# EAGLE design zerocam1S (EAGLE 9.5.0)
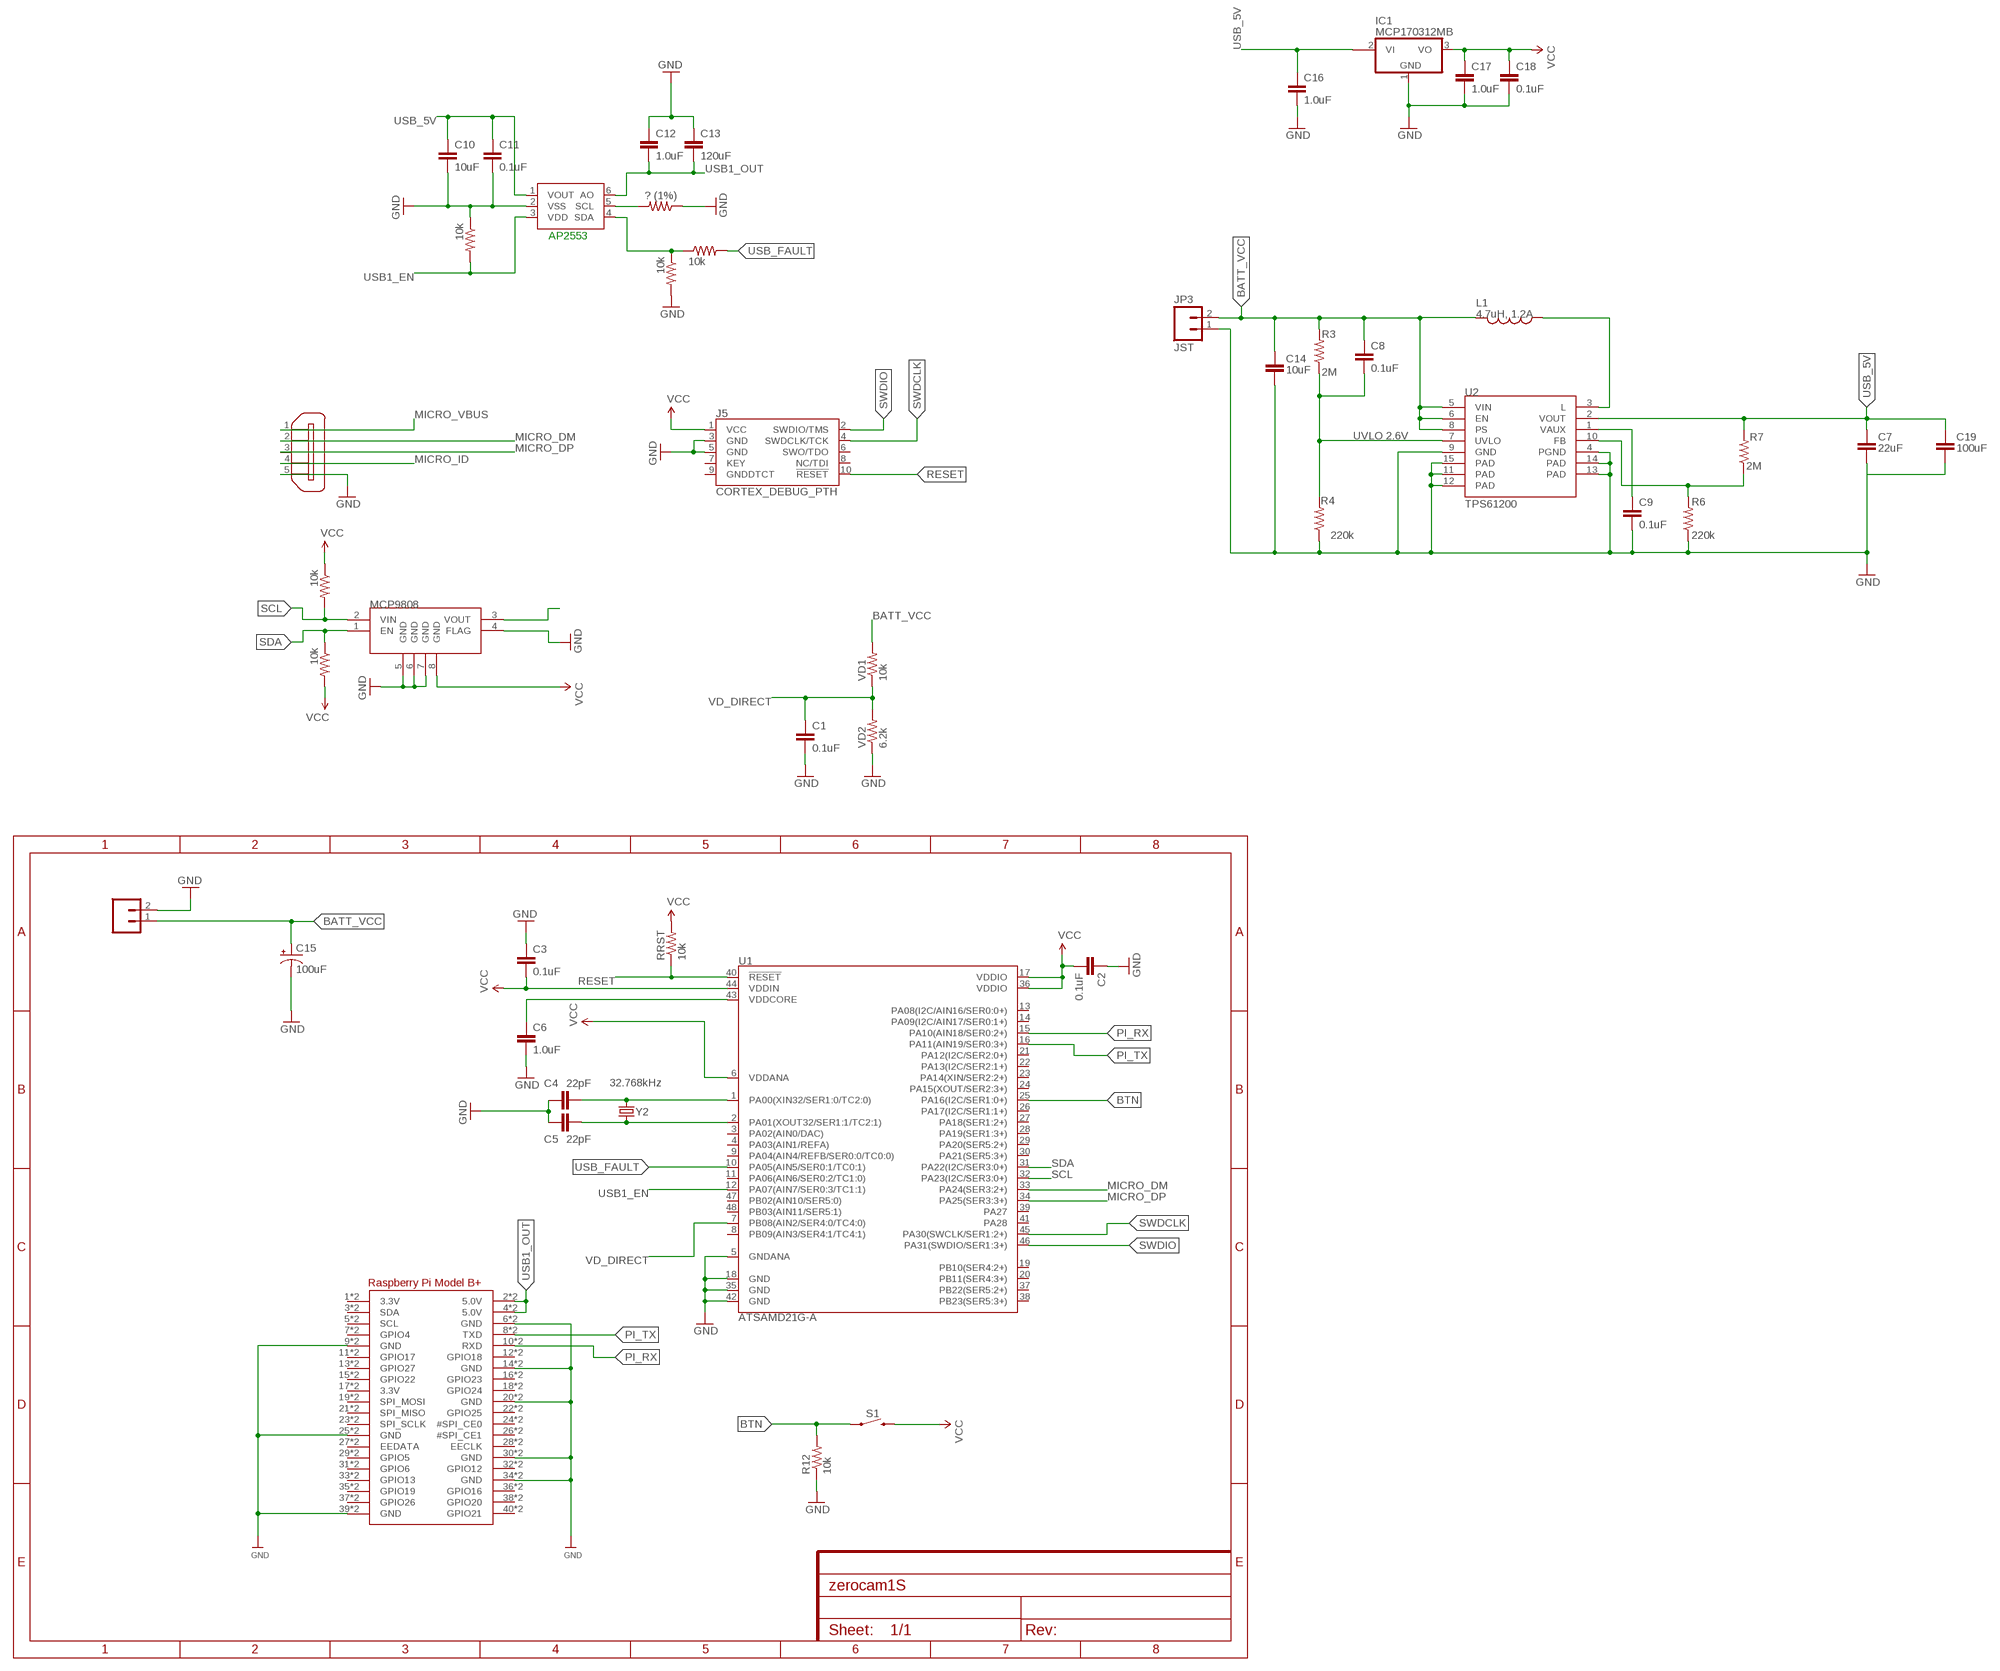
[diagram p0: schematic, sheet 1]

## Parts
AP2553  MCP4725  MCP4725SOT-23  [SOT23-6]
C1  0.1uF  CAP0805  [0805]
C2  0.1uF  1.0UF-0805-25V-10%  [0805]
C3  0.1uF  1.0UF-0805-25V-10%  [0805]
C4  22pF  CAP0805  [0805]
C5  22pF  CAP0805  [0805]
C6  1.0uF  1.0UF-0805-25V-10%  [0805]
C7  22uF  CAP0805  [0805]
C8  0.1uF  CAP0805  [0805]
C9  0.1uF  CAP0805  [0805]
C10  10uF  1.0UF-0805-25V-10%  [0805]
C11  0.1uF  1.0UF-0805-25V-10%  [0805]
C12  1.0uF  1.0UF-1206-50V-10%  [1206]
C13  120uF  1.0UF-1206-50V-10%  [1206]
C14  10uF  CAP1206  [1206]
C15  100uF  100UF-POLAR-25V-20%(ELEC)  [PANASONIC_D]
C16  1.0uF  1.0UF-0805-25V-10%  [0805]
C17  1.0uF  1.0UF-1206-50V-10%  [1206]
C18  0.1uF  1.0UF-0805-25V-10%  [0805]
C19  100uF  CAP1206  [1206]
IC1  MCP170312MB  [SOT89]
J1  CONN_023.5MM-NO_SILK  [SCREWTERMINAL-3.5MM-2-NS]
J5  CORTEX_DEBUG_PTH  [2X5-PTH-1.27MM]
JP3  JST  M02-JST-2MM-SMT  [JST-2-SMD]
L1  4.7uH, 1.2A  INDUCTOR.  [CDRH2D09]
MCP9808  V_REG_MIC5216  [MSOP8]
R3  2M  RESISTOR0805-RES  [0805]
R4  220k  RESISTOR0805-RES  [0805]
R6  220k  RESISTOR0805-RES  [0805]
R7  2M  RESISTOR0805-RES  [0805]
R12  10k  RESISTOR0805-RES  [0805]
R_I2C_1  10k  RESISTOR0805-RES  [0805]
R_I2C_2  10k  RESISTOR0805-RES  [0805]
R_MOSFET_USB1  ? (1%)  RESISTOR0805-RES  [0805]
R_MOSFET_USB2  10k  RESISTOR0805-RES  [0805]
R_MOSFET_USB3  10k  RESISTOR0805-RES  [0805]
R_MOSFET_USB4  10k  RESISTOR0805-RES  [0805]
RPI1  RASPBERRYPI_BPLUS_BONNET_THMSMT  [PI_BONNET_THMSMT]
RRST  10k  RESISTOR0805-RES  [0805]
S1  MOMENTARY-SWITCH-SPST-SMD-5.2-REDUNDANT  [TACTILE_SWITCH_SMD_5.2MM]
U1  ATSAMD21G-A  [TQFP-48]
U2  TPS61200  [QFN-10_PAD]
VD1  10k  RESISTOR0805-RES  [0805]
VD2  6.2k  RESISTOR0805-RES  [0805]
X2  ZX62D-B-5PA8  [ZX62D-B-5PA8]
Y2  32.768kHz  CRYSTAL3.2X1.5MM  [CRYSTAL-SMD-3.2X1.5MM]

## Nets
BATT_VCC: C8.1 C14.1 C15.+ J1.1 JP3.2 L1.P$2 R3.2 U2.5(VIN) U2.6(EN) U2.8(PS) VD1.2
BTN: R12.2 S1.1 S1.2 U1.25(PA16(I2C/SER1:0+))
FB: R6.2 R7.1 U2.10(FB)
GND: AP2553.2(VSS) C1.2 C2.1 C3.1 C4.1 C5.1 C6.2 C7.2 C9.2 C10.2 C11.2 C12.1 C13.1 C14.2 C15.- C16.2 C17.2 C18.2 C19.2 IC1.1(GND) J1.2 J5.3(GND) J5.5(GND) JP3.1 MCP9808.4(FLAG) MCP9808.5(GND) MCP9808.6(GND) MCP9808.7(GND) R4.1 R6.1 R12.1 R_MOSFET_USB1.1 R_MOSFET_USB2.2 R_MOSFET_USB3.1 RPI1.6(GND) RPI1.9(GND) RPI1.14(GND) RPI1.20(GND) RPI1.25(GND) RPI1.30(GND) RPI1.34(GND) RPI1.39(GND) RPI1.S6(GND) RPI1.S9(GND) RPI1.S14(GND) RPI1.S20(GND) RPI1.S25(GND) RPI1.S30(GND) RPI1.S34(GND) RPI1.S39(GND) U1.5(GNDANA) U1.18(GND) U1.35(GND) U1.42(GND) U2.4(PGND) U2.9(GND) U2.11(PAD) U2.12(PAD) U2.13(PAD) U2.14(PAD) U2.15(PAD) VD2.1 X2.5
MICRO_DM: U1.33(PA24(SER3:2+)) X2.2
MICRO_DP: U1.34(PA25(SER3:3+)) X2.3
MICRO_ID: X2.4
MICRO_VBUS: X2.1
N$1: C6.1 U1.43(VDDCORE)
N$2: L1.P$1 U2.3(L)
N$3: AP2553.5(SCL) R_MOSFET_USB1.2
N$4: MCP9808.3(VOUT)
N$5: AP2553.4(SDA) R_MOSFET_USB2.1 R_MOSFET_USB4.1
N$6: C9.1 U2.1(VAUX)
N$8: C4.2 U1.1(PA00(XIN32/SER1:0/TC2:0)) Y2.P$2
N$32: C5.2 U1.2(PA01(XOUT32/SER1:1/TC2:1)) Y2.P$1
PI_RX: RPI1.10(RXD) RPI1.S10(RXD) U1.15(PA10(AIN18/SER0:2+))
PI_TX: RPI1.8(TXD) RPI1.S8(TXD) U1.16(PA11(AIN19/SER0:3+))
RESET: J5.10(!RESET) RRST.1 U1.40(!RESET!)
SCL: MCP9808.2(VIN) R_I2C_1.2 U1.32(PA23(I2C/SER3:0+))
SDA: MCP9808.1(EN) R_I2C_2.1 U1.31(PA22(I2C/SER3:0+))
SWDCLK: J5.4(SWDCLK/TCK) U1.45(PA30(SWCLK/SER1:2+))
SWDIO: J5.2(SWDIO/TMS) U1.46(PA31(SWDIO/SER1:3+))
USB1_EN: AP2553.3(VDD) R_MOSFET_USB3.2 U1.12(PA07(AIN7/SER0:3/TC1:1))
USB1_OUT: AP2553.6(AO) C12.2 C13.2 RPI1.2(5.0V) RPI1.4(5.0V) RPI1.S2(5.0V) RPI1.S4(5.0V)
USB_5V: AP2553.1(VOUT) C7.1 C10.1 C11.1 C16.1 C19.1 IC1.2@1(VI1) R7.2 U2.2(VOUT)
USB_FAULT: R_MOSFET_USB4.2 U1.10(PA05(AIN5/SER0:1/TC0:1))
UVLO: C8.2 R3.1 R4.2 U2.7(UVLO)
VCC [power]: C2.2 C3.2 C17.1 C18.1 IC1.3(VO) J5.1(VCC) MCP9808.8(GND) R_I2C_1.1 R_I2C_2.2 RRST.2 S1.3 S1.4 U1.6(VDDANA) U1.17(VDDIO) U1.36(VDDIO) U1.44(VDDIN)
VD_DIRECT: C1.1 U1.7(PB08(AIN2/SER4:0/TC4:0)) VD1.1 VD2.2
Unconnected: IC1.2(VI) J5.6(SWO/TDO) J5.7(KEY) J5.8(NC/TDI) J5.9(GNDDTCT) RPI1.1(3.3V) RPI1.3(SDA) RPI1.5(SCL) RPI1.7(GPIO4) RPI1.11(GPIO17) RPI1.12(GPIO18) RPI1.13(GPIO27) RPI1.15(GPIO22) RPI1.16(GPIO23) RPI1.17(3.3V) RPI1.18(GPIO24) RPI1.19(SPI_MOSI) RPI1.21(SPI_MISO) RPI1.22(GPIO25) RPI1.23(SPI_SCLK) RPI1.24(#SPI_CE0) RPI1.26(#SPI_CE1) RPI1.27(EEDATA) RPI1.28(EECLK) RPI1.29(GPIO5) RPI1.31(GPIO6) RPI1.32(GPIO12) RPI1.33(GPIO13) RPI1.35(GPIO19) RPI1.36(GPIO16) RPI1.37(GPIO26) RPI1.38(GPIO20) RPI1.40(GPIO21) RPI1.S1(3.3V) RPI1.S3(SDA) RPI1.S5(SCL) RPI1.S7(GPIO4) RPI1.S11(GPIO17) RPI1.S12(GPIO18) RPI1.S13(GPIO27) RPI1.S15(GPIO22) RPI1.S16(GPIO23) RPI1.S17(3.3V) RPI1.S18(GPIO24) RPI1.S19(SPI_MOSI) RPI1.S21(SPI_MISO) RPI1.S22(GPIO25) RPI1.S23(SPI_SCLK) RPI1.S24(#SPI_CE0) RPI1.S26(#SPI_CE1) RPI1.S27(EEDATA) RPI1.S28(EECLK) RPI1.S29(GPIO5) RPI1.S31(GPIO6) RPI1.S32(GPIO12) RPI1.S33(GPIO13) RPI1.S35(GPIO19) RPI1.S36(GPIO16) RPI1.S37(GPIO26) RPI1.S38(GPIO20) RPI1.S40(GPIO21) U1.3(PA02(AIN0/DAC)) U1.4(PA03(AIN1/REFA)) U1.8(PB09(AIN3/SER4:1/TC4:1)) U1.9(PA04(AIN4/REFB/SER0:0/TC0:0)) U1.11(PA06(AIN6/SER0:2/TC1:0)) U1.13(PA08(I2C/AIN16/SER0:0+)) U1.14(PA09(I2C/AIN17/SER0:1+)) U1.19(PB10(SER4:2+)) U1.20(PB11(SER4:3+)) U1.21(PA12(I2C/SER2:0+)) U1.22(PA13(I2C/SER2:1+)) U1.23(PA14(XIN/SER2:2+)) U1.24(PA15(XOUT/SER2:3+)) U1.26(PA17(I2C/SER1:1+)) U1.27(PA18(SER1:2+)) U1.28(PA19(SER1:3+)) U1.29(PA20(SER5:2+)) U1.30(PA21(SER5:3+)) U1.37(PB22(SER5:2+)) U1.38(PB23(SER5:3+)) U1.39(PA27) U1.41(PA28) U1.47(PB02(AIN10/SER5:0)) U1.48(PB03(AIN11/SER5:1)) X2.S1 X2.S2 X2.S3 X2.S4

## Notes on the sheet
- AP2553
- UVLO 2.6V

## Library data of the parts
AP2553 = SparkFun-IC-Conversion:MCP4725: MCP4725 DAC Microchip 12-bit I2C DAC, SOT23-6 Datasheet <https://cdn.sparkfun.com/datasheets/BreakoutBoards/MCP4725_2009.pdf> SparkFun Products SparkFun I2C DAC Breakout - MCP4725 <https://www.sparkfun.com/products/12918> (BOB-12918); PROD_ID: IC-08886
C1 = SparkFun-Capacitors:CAP: Capacitor Standard 0603 ceramic capacitor, and 0.1" leaded capacitor.
C2 C3 C10 C11 C18 = SparkFun-Capacitors:1.0UF: 1µF ceramic capacitors A capacitor is a passive two-terminal electrical component used to store electrical energy temporarily in an electric field.; PROD_ID: CAP-08064; VALUE: 1.0uF
C4 C5 = SparkFun-Passives:CAP: Capacitor Standard 0603 ceramic capacitor, and 0.1" leaded capacitor.
C6 C16 = SparkFun-Capacitors:1.0UF: 1µF ceramic capacitors A capacitor is a passive two-terminal electrical component used to store electrical energy temporarily in an electric field.; PROD_ID: CAP-08064
C7 C14 C19 = CH_passive:CAP: Capacitor Standard 0603 ceramic capacitor, and 0.1" leaded capacitor.
C8 C9 = SparkFun:CAP: Capacitor Standard 0603 ceramic capacitor, and 0.1" leaded capacitor.
C12 C17 = SparkFun-Capacitors:1.0UF: 1µF ceramic capacitors A capacitor is a passive two-terminal electrical component used to store electrical energy temporarily in an electric field.; PROD_ID: CAP-09822
C13 = SparkFun-Capacitors:1.0UF: 1µF ceramic capacitors A capacitor is a passive two-terminal electrical component used to store electrical energy temporarily in an electric field.; PROD_ID: CAP-09822; VALUE: 1.0uF
C15 = SparkFun-Capacitors:100UF-POLAR: 100µF polarized capacitors A capacitor is a passive two-terminal electrical component used to store electrical energy temporarily in an electric field.; PROD_ID: CAP-12547
IC1 = linear:MCP1703*: 250 mA, 16V, Low Quiescent Current LDO Regulator Source: http://ww1.microchip.com/downloads/en/DeviceDoc/22049b.pdf
J1 = SparkFun-Connectors:CONN_02: Multi connection point. Often used as Generic Header-pin footprint for 0.1 inch spaced/style header connections On any of the 0.1 inch spaced packages, you can populate with these: Break Away Headers - Straight <https://www.sparkfun.com/products/116> (PRT-00116) Break Away Male Headers - Right Angle <https://www.sparkfun.com/products/553> (PRT-00553) Female Headers <https://www.sparkfun.com/products/115> (PRT-00115) Break Away Headers - Machine Pin <https://www.sparkfun.com/products/117> (PRT-00117) Break Away Female Headers - Swiss Machine Pin <https://www.sparkfun.com/products/743> (PRT-00743) For SCREWTERMINALS and SPRING TERMINALS visit here: Screw Terimnals on SparkFun.com <https://www.sparkfun.com/search/results?term=Screw+Terminals> (5mm/3.5mm/2.54mm spacing) This device is also useful as a general connection point to wire up your design to another part of your project. Our various solder wires solder well into these plated through hole pads. Hook-Up Wire - Assortment (Stranded, 22 AWG) <https://www.sparkfun.com/products/11375> (PRT-11375) Hook-Up Wire - Assortment (Solid Core, 22 AWG) <https://www.sparkfun.com/products/11367> (PRT-11367) View the entire wire category on our website here <https://www.sparkfun.com/categories/141> Special notes: Molex polarized connector foot print use with: PRT-08233 with associated crimp pins and housings. 2.54_SCREWTERM for use with PRT-10571. 3.5mm Screw Terminal footprints for PRT-08084 5mm Screw Terminal footprints for use with PRT-08432; PROD_ID: CONN-08399
J5 = SparkFun-Connectors:CORTEX_DEBUG: Cortex Debug Connector - 10 pin Supports JTAG debug, Serial Wire debug, and Serial Wire Viewer. PTH and SMD connector options available. General Connector Information <http://infocenter.arm.com/help/topic/com.arm.doc.faqs/attached/13634/cortex_debug_connectors.pdf> Products: PTH Connector <http://www.digikey.com/product-detail/en/cnc-tech/3220-10-0100-00/1175-1627-ND/3883661> -via Digi-Key SparkFun PSoc <https://www.sparkfun.com/products/13229> SparkFun T <https://www.sparkfun.com/products/13810>
JP3 = SparkFun:M02: Header 2 Standard 2-pin 0.1" header. Use with straight break away headers (SKU : PRT-00116), right angle break away headers (PRT-00553), swiss pins (PRT-00743), machine pins (PRT-00117), and female headers (PRT-00115). Molex polarized connector foot print use with SKU : PRT-08233 with associated crimp pins and housings.
L1 = SparkFun:INDUCTOR: Inductors Basic Inductor/Choke - 0603 and 1206. Footprints are not proven and vary greatly between part numbers.
MCP9808 = SparkFun-IC-Power:V_REG_MIC5216: 500mA LDO, MSOP8 for better dissipation; PROD_ID: IC-09527
R3 R4 R6 R7 = SparkFun:RESISTOR: Resistor Basic schematic elements and footprints for 0603, 1206, and PTH resistors.
R12 R_I2C_1 R_I2C_2 R_MOSFET_USB1-R_MOSFET_USB4 RRST VD1 VD2 = SparkFun-Passives:RESISTOR: Resistor Basic schematic elements and footprints for 0603, 1206, and PTH resistors.
RPI1 = microbuilder:RASPBERRYPI_BPLUS
S1 = SparkFun-Switches:MOMENTARY-SWITCH-SPST: Momentary Switch (Pushbutton) - SPST Normally-open (NO) SPST momentary switches (buttons, pushbuttons). Variants PTH-12MM - 12mm square, through-hole Momentary Pushbutton Switch - 12mm Square <https://www.sparkfun.com/products/9190> (COM-09190) PTH-6.0MM, PTH-6.0MM-KIT - 6.0mm square, through-hole Mini Pushbutton Switch <https://www.sparkfun.com/products/97> (COM-00097) KIT package intended for soldering kit's - only one side of pads' copper is exposed. PTH-RIGHT-ANGLE-KIT - Right-angle, through-hole Right Angle Tactile Button <https://www.sparkfun.com/products/10791> - Used on SparkFun BigTime Watch Kit <https://www.sparkfun.com/products/11734> SMD-12MM - 12mm square, surface-mount Tactile Button - SMD (12mm) <https://www.sparkfun.com/products/12993> (COM-12993) Used on SparkFun PicoBoard <https://www.sparkfun.com/products/11888> SMD-4.5MM - 4.5mm Square Trackball Switch Used on SparkFun Blackberry Trackballer Breakout <https://www.sparkfun.com/products/13169> SMD-4.6MMX2.8MM - 4.60mm x 2.80mm, surface mount Used on SparkFun SAMD21 Mini Breakout <https://www.sparkfun.com/products/13664> SMD-5.2MM, SMD-5.2-REDUNDANT - 5.2mm square, surface-mount Mini Pushbutton Switch - SMD <https://www.sparkfun.com/products/8720> (COM-08720) Used on Arduino Pro Mini <https://www.sparkfun.com/products/11114> REDUNDANT package connects both switch circuits together SMD-6.0X3.5MM - 6.0 x 3.5mm, surface mount Momentary Reset Switch SMD <https://www.sparkfun.com/products/8229> (COM-08229) SMD-6.2MM-TALL - 6.2mm square, surface mount Tactile Button - SMD (6mm) <https://www.sparkfun.com/products/12992> Used on SparkFun Digital Sandbox <https://www.sparkfun.com/products/12651> SMD-RIGHT-ANGLE - Right-angle, surface mount Used on SparkFun Block for Intel® Edison - Arduino <https://www.sparkfun.com/products/13036>; PROD_ID: SWCH-08247; SF_SKU: COM-08720
U1 = SparkFun-IC-Microcontroller:ATSAMD21G: Atmel SAMD21G SMART ARM-Based Microcontroller The Atmel ® | SMART ™ SAM D21 is a series of low-power microcontrollers using the 32-bit ARM ® Cortex ® -M0+ processor, and ranging from 32- to 64-pins with up to 256KB Flash and 32KB of SRAM. The SAM D21 devices operate at a maximum frequency of 48MHz and reach 2.46 CoreMark/MHz. They are designed for simple and intuitive migration with identical peripheral modules, hex compatible code, identical linear address map and pin compatible migration paths between all devices in the product series. All devices include intelligent and flexible peripherals, Atmel Event System for inter-peripheral signaling, and support for capacitive touch button, slider and wheel user interfaces. Datasheet <https://cdn.sparkfun.com/datasheets/Dev/Arduino/Boards/Atmel-42181-SAM-D21_Datasheet.pdf> SparkFun Products SparkFun SAMD21 Mini Breakout <https://www.sparkfun.com/products/13664> (DEV-13664) SparkFun SAMD21 Dev Breakout <https://www.sparkfun.com/products/13672> (DEV-13672); PROD_ID: IC-13064
U2 = SparkFun:TPS61200: DC to DC Booster
X2 = zx62d-b-5pa8-oshpark_10:ZX62D-B-5PA8: Micro USB Type B Connector - Standard, Shell Through Hole Source: http://www.hirose.co.jp/cataloge_hp/ed_ZX_20140804.pdf; MF: Hirose; MPN: ZX62D-B-5PA8; OC_FARNELL: 2300438; OC_NEWARK: 69W0712
Y2 = samd21-temp:CRYSTAL: Various standard crystals. Proven footprints.; PROD_ID: XTAL-13062

## Net classes
1 power: width 0.254 mm, clearance 0.203 mm
4 highpower: clearance 0.305 mm

## Board
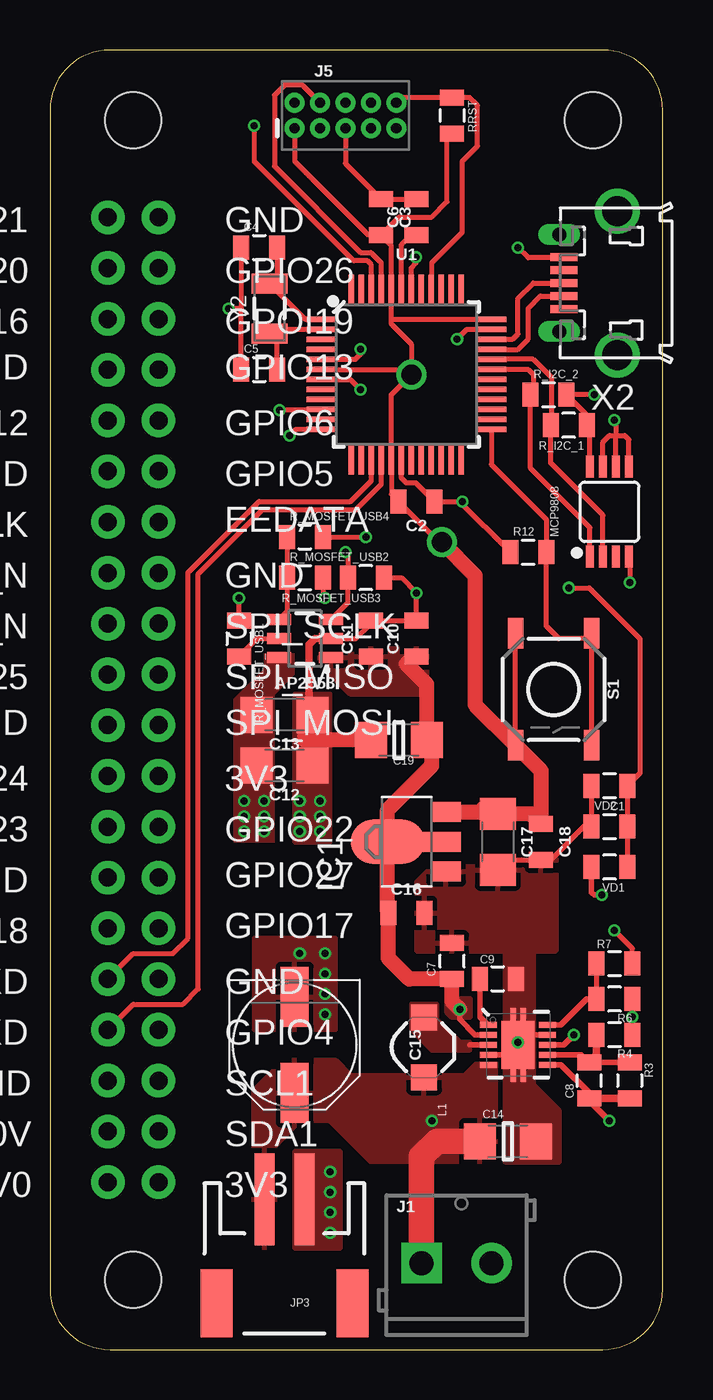
[diagram p1: board, top side]
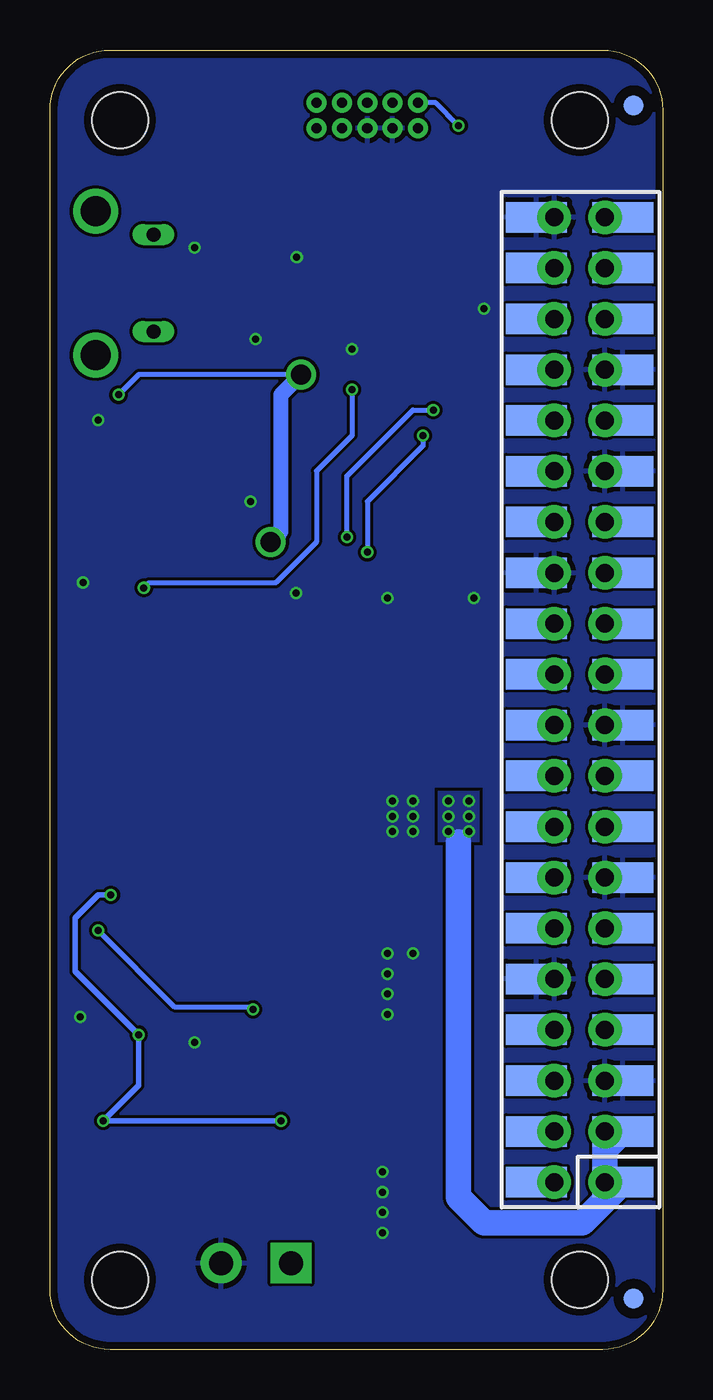
[diagram p2: board, bottom side, seen from below]

Size 30.66 x 65 mm. Coordinates in mm from the lower left corner, seen from the top.
Copper layers (1*16): Top 0.035559375mm / dielectric 1.6mm / Bottom 0.035559375mm
Design rules "oshpark-2layer": minimum track width 6mil, minimum drill 10mil, track to track 6mil, track to pad 6mil, pad to pad 6mil, via to via 6mil, smd to smd 6mil, copper to edge 15mil, drill to drill 6mil, minimum pad ring 5mil, minimum via ring 5mil, stop-mask expansion 2.5mil, vias tented up to drill 0mil, thermal gap 10mil

### Footprints (pad centres in the part's own frame; a part is rotated, then mirrored left to right if it is on the bottom)
SOT23-6 = smd 0.55 x 1.2: 1 0.95,1.3; 2 0,1.3; 3 -0.95,1.3; 4 -0.95,-1.3; 5 0,-1.3; 6 0.95,-1.3
0805 = smd 0.8 x 1.2: 1 -0.9,0; 2 0.9,0
1206 = smd 1.6 x 1.8: 1 -1.4,0; 2 1.4,0
PANASONIC_D = smd 3 x 1.4: + 2.4,0; - -2.4,0
SOT89 = smd 1 x 1.5: 1 -1.499,-1.981; 3 1.499,-1.981 | smd 1 x 2: 2 0,-1.727 | smd 2.2 x 3.7: 2@1 0,0.94
SCREWTERMINAL-3.5MM-2-NS = drill 1.2 pad 2.032 square: 1 0,0 | drill 1.2 pad 2.032: 2 3.5,0
2X5-PTH-1.27MM = drill 0.508 pad 1: 1 -2.54,-0.635; 2 -2.54,0.635; 3 -1.27,-0.635; 4 -1.27,0.635; 5 0,-0.635; 6 0,0.635; 7 1.27,-0.635; 8 1.27,0.635; 9 2.54,-0.635; 10 2.54,0.635
JST-2-SMD = smd 1 x 4.6: 1 -1,-3.7; 2 1,-3.7 | smd 1.6 x 3.4: NC1 -3.4,1.5; NC2 3.4,1.5
CDRH2D09 = smd 1.3 x 1.3: P$1 -1.5,0; P$2 1.5,0
MSOP8 = smd 0.4 x 1.1: 1 -0.975,-2.25; 2 -0.325,-2.25; 3 0.325,-2.25; 4 0.975,-2.25; 5 0.975,2.25; 6 0.325,2.25; 7 -0.325,2.25; 8 -0.975,2.25
PI_BONNET_THMSMT = drill 0.9 pad 1.676: 1 8.37,25.23; 2 8.37,27.77; 3 10.91,25.23; 4 10.91,27.77; 5 13.45,25.23; 6 13.45,27.77; 7 15.99,25.23; 8 15.99,27.77; 9 18.53,25.23; 10 18.53,27.77; 11 21.07,25.23; 12 21.07,27.77; 13 23.61,25.23; 14 23.61,27.77; 15 26.15,25.23; 16 26.15,27.77; 17 28.69,25.23; 18 28.69,27.77; 19 31.23,25.23; 20 31.23,27.77; 21 33.77,25.23; 22 33.77,27.77; 23 36.31,25.23; 24 36.31,27.77; 25 38.85,25.23; 26 38.85,27.77; 27 41.39,25.23; 28 41.39,27.77; 29 43.93,25.23; 30 43.93,27.77; 31 46.47,25.23; 32 46.47,27.77; 33 49.01,25.23; 34 49.01,27.77; 35 51.55,25.23; 36 51.55,27.77; 37 54.09,25.23; 38 54.09,27.77; 39 56.63,25.23; 40 56.63,27.77 | smd 1 x 1 bottom: 41 2.54,29.21; 42 62.23,29.21 | smd 1.524 x 3.048 bottom: S1 8.37,24.339; S2 8.37,28.657; S3 10.91,24.339; S4 10.91,28.657; S5 13.45,24.339; S6 13.45,28.657; S7 15.99,24.339; S8 15.99,28.657; S9 18.53,24.339; S10 18.53,28.657; S11 21.07,24.339; S12 21.07,28.657; S13 23.61,24.339; S14 23.61,28.657; S15 26.15,24.339; S16 26.15,28.657; S17 28.69,24.339; S18 28.69,28.657; S19 31.23,24.339; S20 31.23,28.657; S21 33.77,24.339; S22 33.77,28.657; S23 36.31,24.339; S24 36.31,28.657; S25 38.85,24.339; S26 38.85,28.657; S27 41.39,24.339; S28 41.39,28.657; S29 43.93,24.339; S30 43.93,28.657; S31 46.47,24.339; S32 46.47,28.657; S33 49.01,24.339; S34 49.01,28.657; S35 51.55,24.339; S36 51.55,28.657; S37 54.09,24.339; S38 54.09,28.657; S39 56.63,24.339; S40 56.63,28.657 | hole 2.8: 3.5,26.5; 61.5,26.5; 61.5,3.5; 3.5,3.5
TACTILE_SWITCH_SMD_5.2MM = smd 1.524 x 0.762: 1 -2.794,1.905; 2 2.794,1.905; 3 -2.794,-1.905; 4 2.794,-1.905
TQFP-48 = smd 1.5 x 0.28: 1 -4.25,2.75; 2 -4.25,2.25; 3 -4.25,1.75; 4 -4.25,1.25; 5 -4.25,0.75; 6 -4.25,0.25; 7 -4.25,-0.25; 8 -4.25,-0.75; 9 -4.25,-1.25; 10 -4.25,-1.75; 11 -4.25,-2.25; 12 -4.25,-2.75; 25 4.25,-2.75; 26 4.25,-2.25; 27 4.25,-1.75; 28 4.25,-1.25; 29 4.25,-0.75; 30 4.25,-0.25; 31 4.25,0.25; 32 4.25,0.75; 33 4.25,1.25; 34 4.25,1.75; 35 4.25,2.25; 36 4.25,2.75 | smd 0.28 x 1.5: 13 -2.75,-4.25; 14 -2.25,-4.25; 15 -1.75,-4.25; 16 -1.25,-4.25; 17 -0.75,-4.25; 18 -0.25,-4.25; 19 0.25,-4.25; 20 0.75,-4.25; 21 1.25,-4.25; 22 1.75,-4.25; 23 2.25,-4.25; 24 2.75,-4.25; 37 2.75,4.25; 38 2.25,4.25; 39 1.75,4.25; 40 1.25,4.25; 41 0.75,4.25; 42 0.25,4.25; 43 -0.25,4.25; 44 -0.75,4.25; 45 -1.25,4.25; 46 -1.75,4.25; 47 -2.25,4.25; 48 -2.75,4.25
QFN-10_PAD = smd 0.297 x 0.85: 1 -1,-1.475; 2 -0.5,-1.475; 3 0,-1.475; 4 0.5,-1.475; 5 1,-1.475; 6 1,1.475; 7 0.5,1.475; 8 0,1.475; 9 -0.5,1.475; 10 -1,1.475 | smd 0.7 x 0.28: 11 -1.5,0.25; 12 -1.5,-0.25; 13 1.5,0.25; 14 1.5,-0.25 | smd 2.4 x 1.65: 15 0,0
ZX62D-B-5PA8 = smd 1.35 x 0.4: 1 4.825,1.3; 2 4.825,0.65; 3 4.825,0; 4 4.825,-0.65; 5 4.825,-1.3 | drill 1.5: S1 2.15,-3.6; S2 2.15,3.6 | drill 0.7 long: S3 5.05,2.425; S4 5.05,-2.425
CRYSTAL-SMD-3.2X1.5MM = smd 1 x 1.8: P$1 -1.25,0; P$2 1.25,0

### Placement (x,y rotation side)
AP2553  12.75,35.56 270 top
C1  27.99,28.19 180 top
C2  18.34,42.42 180 top
C3  16.56,56.64 270 top
C4  10.47,55.12 0 top
C5  10.47,49.02 0 top
C6  18.34,56.64 90 top
C7  20.12,19.43 90 top
C8  26.98,13.46 90 top
C9  22.41,18.54 0 top
C10  18.34,35.56 90 top
C11  16.06,35.56 90 top
C12  11.74,29.21 180 top
C13  11.74,31.75 180 top
C14  22.91,10.41 0 top
C15  12.25,15.24 270 top
C16  17.83,21.84 0 top
C17  22.41,25.4 270 top
C18  24.56,25.4 270 top
C19  17.45,30.48 180 top
IC1  17.83,25.4 90 top
J1  18.6,4.32 0 top
J5  14.79,61.72 0 top
JP3  11.74,3.81 180 top
L1  18.72,15.11 270 top
MCP9808  27.99,41.91 0 top
R3  29.01,13.46 270 top
R4  28.25,15.75 180 top
R6  28.25,17.53 180 top
R7  28.25,19.3 0 top
R12  23.93,39.88 0 top
R_I2C_1  25.96,46.23 180 top
R_I2C_2  24.95,47.75 0 top
R_MOSFET_USB1  9.45,35.56 270 top
R_MOSFET_USB2  12.75,38.61 0 top
R_MOSFET_USB3  15.8,38.61 180 top
R_MOSFET_USB4  12.75,40.64 0 top
RPI1  30.66,0 90 top
RRST  20.12,61.72 270 top
S1  25.2,33.02 270 top
U1  17.83,48.77 0 top
U2  23.42,15.24 270 top
VD1  27.99,24.13 180 top
VD2  27.99,26.16 0 top
X2  30.53,53.34 180 top
Y2  10.98,52.07 90 top

### Tracks (layer width: path | path; a pad name or v marks a point on that pad's centre or on a via)
BATT_VCC  (via drill 0.35)
  Top 0.279: U2.8 25.71,15.24 v26.22,15.75 | v27.99,11.43 26.98,12.45 C8.1 26.98,12.83 25.56,14.24 U2.6 | VD1.2 27.09,22.87 27.23,22.73 v27.61,22.73
  Top 0.381: R3.2 C8.1
  Top 1.27: J1.1 18.6,9.65 19.36,10.41 C14.1
  Bottom 0.279: v27.61,22.73 28.25,22.73 29.39,21.59 29.39,18.92 v26.22,15.75 26.22,13.21 v27.99,11.43 v19.1,11.43
  pour Top: 11.23,5.08 10.21,5.08 10.21,12.95 11.74,14.48 14.28,14.48 15.04,13.72 22.28,13.72 22.28,9.4 16.06,9.4 14.02,11.43 12.5,11.43 11.23,10.16
  pour Top (no thermals): 22.41,14.35 21.52,14.35 21.26,14.35 20.25,13.34 20.25,13.21 22.41,13.21
BTN
  Top 0.254: S1.2 S1.1 26.85,35.56 25.45,35.56 24.83,36.18 24.83,39.62 R12.2 24.83,41.52 22.08,44.26 U1.25
FB
  Top 0.254: R7.1 R6.2
  Top 0.279: U2.10 25.56,16.24 26.85,17.53 R6.2
GND  (via drill 0.35)
  Top 0.254: U1.18 17.58,43.6 17.83,43.35 18.31,43.35 C2.1 20.49,42.42 | AP2553.2 15.29,35.56 16.06,36.32 C11.2 C10.2 v18.34,37.85 17.58,38.61 R_MOSFET_USB3.1 | R_MOSFET_USB1.1 v9.45,37.59 | X2.5 25.68,54.61 23.93,54.61 v23.42,55.12 | MCP9808.4 29.01,39.62 v29.01,38.35 | MCP9808.5 28.97,45.51 28.76,45.72 28.32,45.72 | MCP9808.7 27.67,45.4 27.99,45.72 28.32,45.72 | MCP9808.6 28.32,45.72 | 28.32,45.72 28.32,46.41 v28.25,46.48 | C6.2 C3.1 14.79,59.32 J5.5 | U1.42 18.08,54.1 18.31,54.33 v18.31,54.64 | U1.35 20.85,51.02 v20.37,50.55 | C4.1 9.57,52.07 | 9.57,52.07 v8.94,52.07 | C5.1 9.57,52.07 | U1.5 13.6,49.53 15.29,49.53 15.55,49.78 v15.55,50.04 | C1.2 VD2.1 | R_MOSFET_USB2.2 13.65,37.71 v13.77,37.59 | 20.49,42.42 v20.63,42.42 | R12.1 20.49,42.42 | C17.2 22.91,24.5 C18.2 25.06,24.5 26.72,26.16
  Top 0.279: U2.4 22.92,14.74 U2.15 v23.42,15.37 23.8,15.75 23.81,15.74 U2.9 | R6.1 v29.15,16.64 R4.1 | VD2.1 26.72,26.16
  Top 0.381: AP2553.2 13.26,35.56 12.96,35.26 12.96,31.93 C13.1
  Top 0.762: C19.2 12.75,30.48 12.75,31.37 C13.1
  other vias: 13.77,16.76 13.77,17.78 13.77,18.8 13.77,19.81 12.5,19.81 14.02,5.84 14.02,6.86 14.02,7.87 14.02,8.89 12.5,27.43 13.52,27.43 12.5,26.67 12.5,25.91 13.52,25.91 13.52,26.67
  pour Bottom (rank 2): 0.05,0 30.53,0 30.53,64.77 0.05,64.77
  pour Top: 10.21,20.57 10.21,16 14.28,16 14.28,20.57
  pour Top (no thermals): 12.25,5.08 14.53,5.08 14.53,9.91 12.25,9.91
  pour Top (no thermals): 12.25,32.77 12.25,25.4 14.02,25.4 14.02,32.77 12.25,32.77
  pour Top: 25.33,24.64 21.64,24.64 21.14,24.13 19.1,24.13 18.34,23.37 18.34,19.94 25.33,19.94
  pour Top (no thermals): 25.45,9.4 22.79,9.4 22.79,20.45 24.18,20.45 24.18,13.21 25.45,11.94
MICRO_DM
  Top 0.254: U1.33 23.4,50.02 23.93,50.55 23.93,52.07 24.55,52.69 X2.2
MICRO_DP
  Top 0.254: U1.34 22.11,50.55 23.17,50.55 23.42,50.8 23.42,52.58 24.18,53.34 X2.3
N$1
  Top 0.254: U1.43 17.58,55.26 17.6,55.25 18.09,55.74 C6.1
N$2
  Top 0.279: 21.01,15.24 U2.3
  pour Top (no thermals): 19.36,17.27 18.09,17.27 18.09,16 19.1,14.99 21.01,14.99 21.01,15.37 20.5,15.37 19.99,15.88 19.36,16.51
N$3
  Top 0.254: R_MOSFET_USB1.2 10.35,35.56 AP2553.5
N$5
  Top 0.254: R_MOSFET_USB4.1 R_MOSFET_USB2.1 11.85,36.91 AP2553.4
N$6
  Top 0.279: U2.1 21.91,16.24 21.51,16.65 C9.1
N$8
  Top 0.254: U1.1 12.78,51.52 Y2.P$2 11.37,53.71 C4.2
N$32
  Top 0.254: C5.2 11.37,50.43 Y2.P$1 10.98,50.8 11.19,51.02 11.37,50.84 11.54,51.02 U1.2
PI_RX
  Top 0.254: U1.15 16.08,43.46 15.04,42.42 10.47,42.42 6.91,38.86 6.91,20.57 6.15,19.81 4.17,19.81 RPI1.10 2.88,18.54
  Bottom 0.254: RPI1.S10 | RPI1.S10 RPI1.10
PI_TX
  Top 0.254: RPI1.8 4.17,17.27 6.66,17.27 7.42,18.03 7.42,38.8 10.64,42.01 15.31,42.01 16.58,43.28 U1.16
  Bottom 0.254: RPI1.S8 | RPI1.S8 RPI1.8
RESET
  Top 0.254: 19.85,62.36 RRST.1 | U1.40 19.1,53.04 19.1,54.36 20.63,55.88 20.63,59.44 21.39,60.2 21.39,62.23 21,62.62 RRST.1 | RRST.1 17.59,62.62 J5.10
SCL
  Top 0.254: MCP9808.2 27.67,41.73 25.06,44.33 R_I2C_1.2 25.08,46.25 25.08,48.63 24.18,49.53 22.1,49.53 U1.32
SDA
  Top 0.254: MCP9808.1 27.02,41.11 24.05,44.08 R_I2C_2.1 24.18,47.89 24.18,48.77 23.93,49.02 U1.31
SWDCLK
  Top 0.254: J5.4 12.63,63.25 11.74,63.25 11.23,62.74 11.23,59.18 15.55,54.86 16.06,54.86 16.56,54.36 16.56,53.04 U1.45
SWDIO  (via drill 0.35)
  Top 0.254: U1.46 16.08,54.26 15.89,54.46 15.19,54.46 10.21,59.44 v10.21,61.21
  Bottom 0.254: v10.21,61.21 11.36,62.36 J5.2
USB1_EN  (via drill 0.35)
  Top 0.254: AP2553.3 14.9,37.36 R_MOSFET_USB3.2 14.9,39.76 v14.79,39.88 | U1.12 12.29,46.02 v11.99,45.72
  Bottom 0.254: v11.99,45.72 11.99,45.21 14.79,42.42 v14.79,39.88
USB1_OUT  (via drill 0.35)
  Bottom 0.254: RPI1.S2 | RPI1.S2 RPI1.2 | RPI1.S4 | RPI1.S4 RPI1.4
  Bottom 1.27: RPI1.S4 2.89,10.02 RPI1.2 | RPI1.S2 4.02,6.35 8.94,6.35 10.21,7.62 10.21,25.4
  other vias: 9.71,27.43 10.72,27.43 10.72,26.67 9.71,26.67 9.71,25.91 10.72,25.91
  pour Top (no thermals): 10.72,34.8 10.72,34.04 9.2,32.51 9.2,26.42 9.2,25.4 11.23,25.4 11.23,32.51 11.23,32.77 12.25,33.78 12.25,34.8
  pour Bottom: 11.23,27.94 9.2,27.94 9.2,25.4 11.23,25.4
USB_5V  (via drill 0.35)
  Top 0.254: R7.2 29.15,20.05 v28.25,20.95
  Top 0.279: U2.2 21.27,15.74 20.5,16.51 v20.5,17.02
  Top 0.762: v20.5,17.02 20.12,17.4 C7.1 17.97,18.53 16.93,19.57 C16.1 16.89,21.88 IC1.2@1 16.89,27 19.1,29.21 19.1,30.23 C19.1 18.85,33.27 17.83,34.29 18.2,34.66 C10.1
  Bottom 0.254: v28.25,20.95 24.44,17.14 20.5,17.14 v20.5,17.02
  pour Top: 13.52,34.8 15.29,34.8 15.55,35.05 18.85,35.05 18.85,32.77 15.04,32.77 13.52,34.29
  pour Top (no thermals): 21.01,17.53 21.01,16.64 20.12,16.64 19.87,16.89 19.87,17.27 19.87,17.53
USB_FAULT  (via drill 0.35)
  Top 0.254: R_MOSFET_USB4.2 v15.8,40.64 | v11.48,46.99 11.51,47.02 U1.10
  Bottom 0.254: v15.8,40.64 15.8,43.69 12.5,46.99 v11.48,46.99
UVLO
  Top 0.279: U2.7 26.6,14.74 C8.2 R3.1
  Top 0.381: R4.2 27.35,14.73 C8.2
VCC  (via drill 0.35, 1)
  Top 0.254: C3.2 17.08,55.22 U1.44 17.07,53.01 17.07,51.56 | U1.36 17.12,51.52 17.07,51.56 | MCP9808.8 27.02,46.07 R_I2C_1.1 26.86,46.74 R_I2C_2.2 v27.23,47.75 | J5.1 12.25,59.44 15.94,55.74 C3.2 | C3.2 17.46,56.64 19.1,56.64 19.87,57.4 19.87,60.57 RRST.2 | v19.61,40.39 19.47,40.39 C2.2 17.08,42.78 U1.17 17.08,47.76 v18.09,48.77 | U1.6 17.84,49.02 v18.09,48.77 | 17.07,51.56 17.07,51.31 18.09,50.29 v18.09,48.77 | S1.4 S1.3 23.04,35.56
  Top 0.762: C17.1 21.9,26.8 21.64,27.05 | IC1.3 22.31,26.9 C17.1 | v19.61,40.39 21.27,38.72 21.27,32.25 S1.4 24.56,28.96 C18.1 24.06,26.8 C17.1
  Bottom 0.254: v18.09,48.77 26.22,48.77 v27.23,47.75
  Bottom 0.762: v19.61,40.39 19.1,40.89 19.1,47.75 v18.09,48.77
VD_DIRECT  (via drill 0.35)
  Top 0.254: U1.7 15.04,48.52 v15.55,48.01 | v25.96,38.1 26.98,38.1 29.52,35.56 29.52,28.82 C1.1 VD2.2 VD1.1
  Bottom 0.254: v15.55,48.01 15.55,45.72 17.33,43.94 17.33,40.39 19.36,38.35 25.71,38.35 v25.96,38.1